# EAGLE design h_bridge_shield (EAGLE 7.6.0)
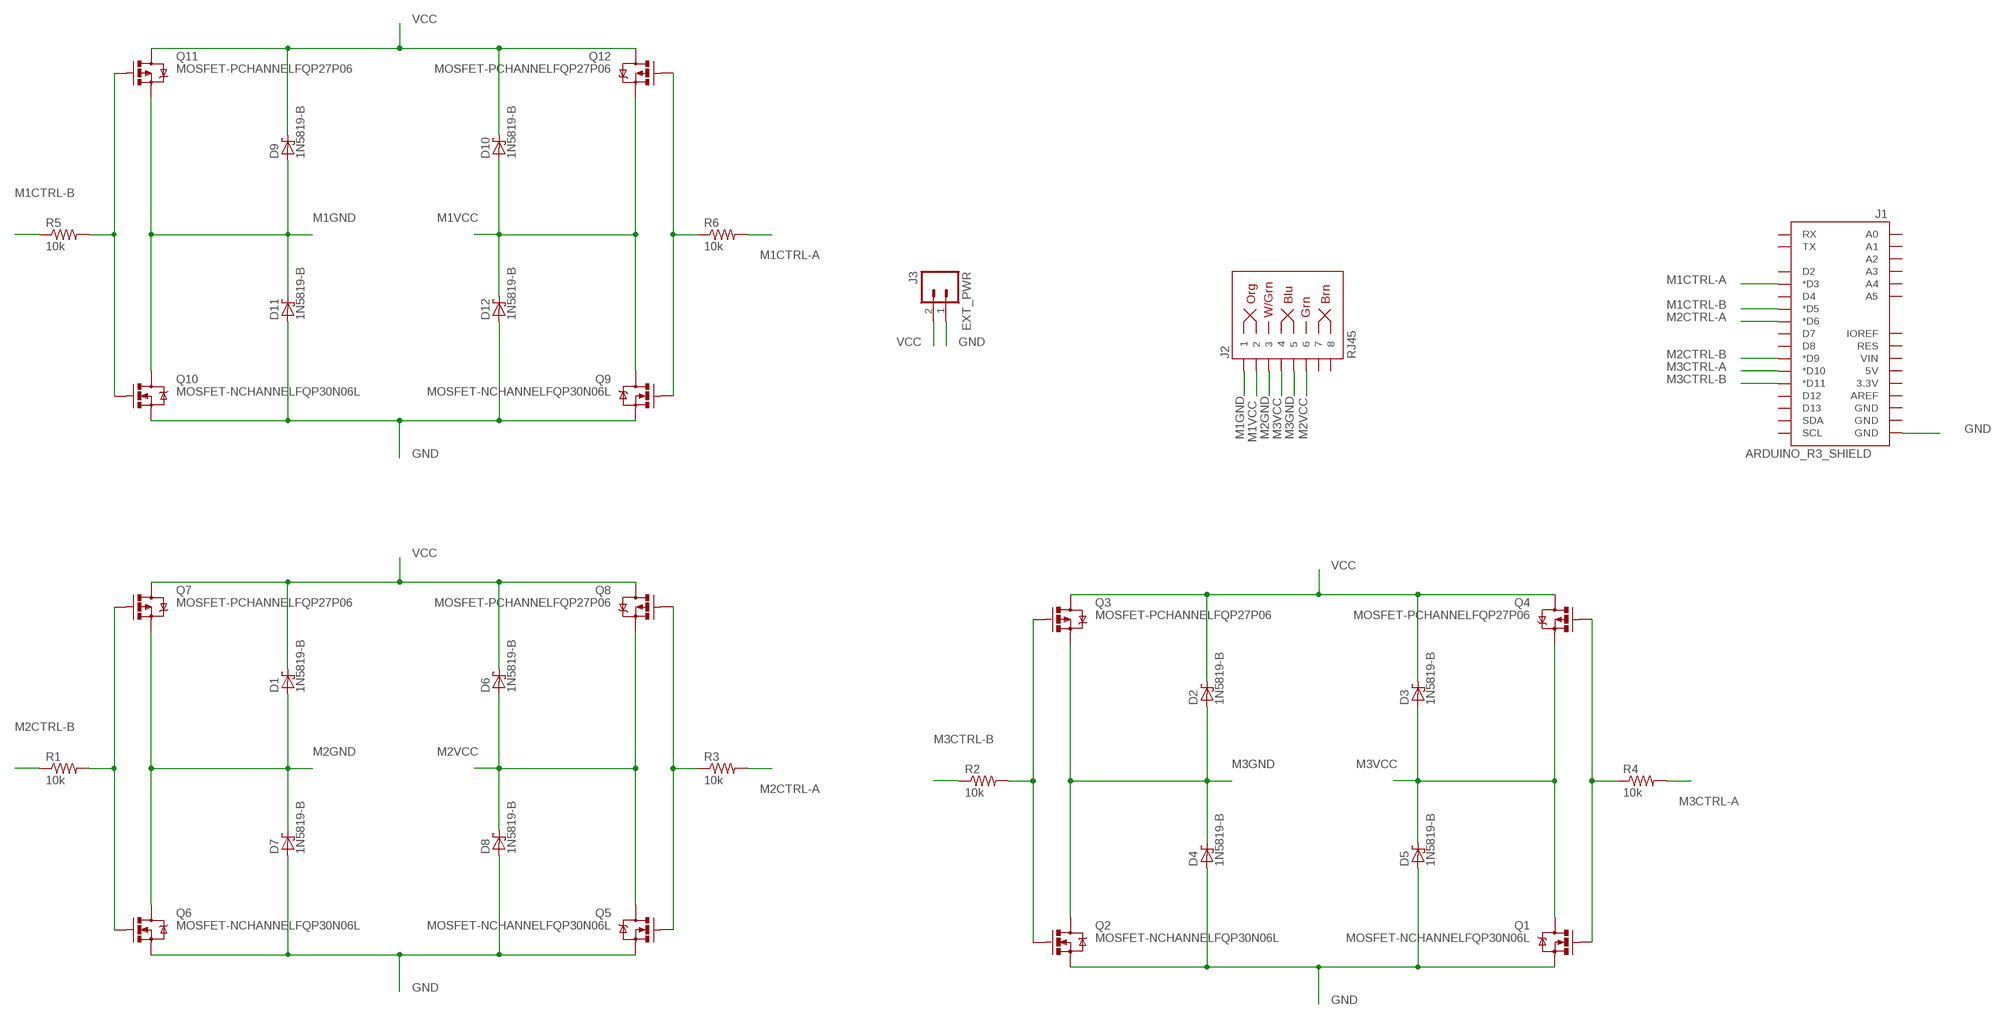
[diagram p0: schematic, sheet 1]

## Parts
D1  1N5819-B  [DO41-7.6]
D2  1N5819-B  [DO41-7.6]
D3  1N5819-B  [DO41-7.6]
D4  1N5819-B  [DO41-7.6]
D5  1N5819-B  [DO41-7.6]
D6  1N5819-B  [DO41-7.6]
D7  1N5819-B  [DO41-7.6]
D8  1N5819-B  [DO41-7.6]
D9  1N5819-B  [DO41-7.6]
D10  1N5819-B  [DO41-7.6]
D11  1N5819-B  [DO41-7.6]
D12  1N5819-B  [DO41-7.6]
J1  ARDUINO_R3_SHIELD  [UNO_R3_SHIELD]
J2  RJ45  RJ45-8PTH  [RJ45-8]
J3  EXT_PWR  M02JST-PTH-VERT  [JST-2-PTH-VERT]
Q1  MOSFET-NCHANNELFQP30N06L  [TO220V]
Q2  MOSFET-NCHANNELFQP30N06L  [TO220V]
Q3  MOSFET-PCHANNELFQP27P06  [TO220V]
Q4  MOSFET-PCHANNELFQP27P06  [TO220V]
Q5  MOSFET-NCHANNELFQP30N06L  [TO220V]
Q6  MOSFET-NCHANNELFQP30N06L  [TO220V]
Q7  MOSFET-PCHANNELFQP27P06  [TO220V]
Q8  MOSFET-PCHANNELFQP27P06  [TO220V]
Q9  MOSFET-NCHANNELFQP30N06L  [TO220V]
Q10  MOSFET-NCHANNELFQP30N06L  [TO220V]
Q11  MOSFET-PCHANNELFQP27P06  [TO220V]
Q12  MOSFET-PCHANNELFQP27P06  [TO220V]
R1  10k  10KOHM-1/4W5%(PTH)  [AXIAL-0.3]
R2  10k  10KOHM-1/4W5%(PTH)  [AXIAL-0.3]
R3  10k  10KOHM-1/4W5%(PTH)  [AXIAL-0.3]
R4  10k  10KOHM-1/4W5%(PTH)  [AXIAL-0.3]
R5  10k  10KOHM-1/4W5%(PTH)  [AXIAL-0.3]
R6  10k  10KOHM-1/4W5%(PTH)  [AXIAL-0.3]

## Nets
GND: D4.A D5.A D7.A D8.A D11.A D12.A J1.GND@0(GND) J3.1 Q1.3(S) Q2.3(S) Q5.3(S) Q6.3(S) Q9.3(S) Q10.3(S)
M1CTRL-A: J1.D3(*D3) R6.P$2
M1CTRL-B: J1.D5(*D5) R5.P$1
M1GND: D9.A D11.C J2.1 Q10.2(D) Q11.3(S)
M1VCC: D10.A D12.C J2.2 Q9.2(D) Q12.3(S)
M2CTRL-A: J1.D6(*D6) R3.P$2
M2CTRL-B: J1.D9(*D9) R1.P$1
M2GND: D1.A D7.C J2.3 Q6.2(D) Q7.3(S)
M2VCC: D6.A D8.C J2.6 Q5.2(D) Q8.3(S)
M3CTRL-A: J1.D10(*D10) R4.P$2
M3CTRL-B: J1.D11(*D11) R2.P$1
M3GND: D2.A D4.C J2.5 Q2.2(D) Q3.3(S)
M3VCC: D3.A D5.C J2.4 Q1.2(D) Q4.3(S)
N$1: Q5.1(G) Q8.1(G) R3.P$1
N$2: Q6.1(G) Q7.1(G) R1.P$2
N$3: Q9.1(G) Q12.1(G) R6.P$1
N$4: Q10.1(G) Q11.1(G) R5.P$2
N$5: Q1.1(G) Q4.1(G) R4.P$1
N$6: Q2.1(G) Q3.1(G) R2.P$2
VCC: D1.C D2.C D3.C D6.C D9.C D10.C J3.2 Q3.2(D) Q4.2(D) Q7.2(D) Q8.2(D) Q11.2(D) Q12.2(D)
Unconnected: J1.3.3V J1.5V J1.A0 J1.A1 J1.A2 J1.A3 J1.A4 J1.A5 J1.AREF J1.D2 J1.D4 J1.D7 J1.D8 J1.D12 J1.D13 J1.GND@1(GND) J1.GND@2(GND) J1.IOREF J1.RES J1.RX J1.SCL J1.SDA J1.TX J1.VIN J2.7 J2.8

## Library data of the parts
D1-D12 = diode:1N581*: 1.0A SCHOTTKY BARRIER RECTIFIER Source: http://www.diodes.com/datasheets/ds23001.pdf
J1 = SparkFun-Boards:ARDUINO_R3_SHIELD: Shield form compatible with the Arduino Uno R3.
J2 = SparkFun-Connectors:RJ45-8: RJ45 Jack Simple RJ45, 8-pin connection - connector for common Cat5, Cat5e, and Cat6 Ethernet cables. Footprint not yet proven in production. Connector sku is PRT-00643; Breakout PCB sku is BOB-00716.; PROD_ID: CONN-08506
J3 = SparkFun-Connectors:M02: Standard 2-pin 0.1" header. Use with - straight break away headers ( PRT-00116) - right angle break away headers (PRT-00553) - swiss pins (PRT-00743) - machine pins (PRT-00117) - female headers (PRT-00115) Molex polarized connector foot print use with: PRT-08233 with associated crimp pins and housings. 2.54_SCREWTERM for use with PRT-10571. 3.5mm Screw Terminal footprints for PRT-08084 5mm Screw Terminal footprints for use with PRT-08432
Q1 Q2 Q5 Q6 Q9 Q10 = SparkFun-DiscreteSemi:MOSFET-NCHANNEL: Common NMOSFET Parts MFG P/N Store ID Prod ID FDD8780 TRANS-09984 SI7820DN TRANS-11055 FDS6630A IC-08089 2N7002PW TRANS-11151 FQP30N06L COM-10213 TRANS-10060 BSS123LT1G TRANS-08345 BSS138 TRANS-00830 BS170 2N7000; PROD_ID: TRANS-10060
Q3 Q4 Q7 Q8 Q11 Q12 = SparkFun-DiscreteSemi:MOSFET-PCHANNEL: Generic PMOSFET IRLML2244 - TRANS-11153 (SOT-23 -20V -4.3A) (1.Gate 2.Source 3.Drain) FQP27P06 - COM-10349 <http://www.sparkfun.com/products/10349> (TO-220 -60V -27A) (1.Gate 2.Source 3.Drain)
R1-R6 = SparkFun-Resistors:10KOHM-1/4W5%(PTH): RES-09435; PROD_ID: RES-9435

## Board
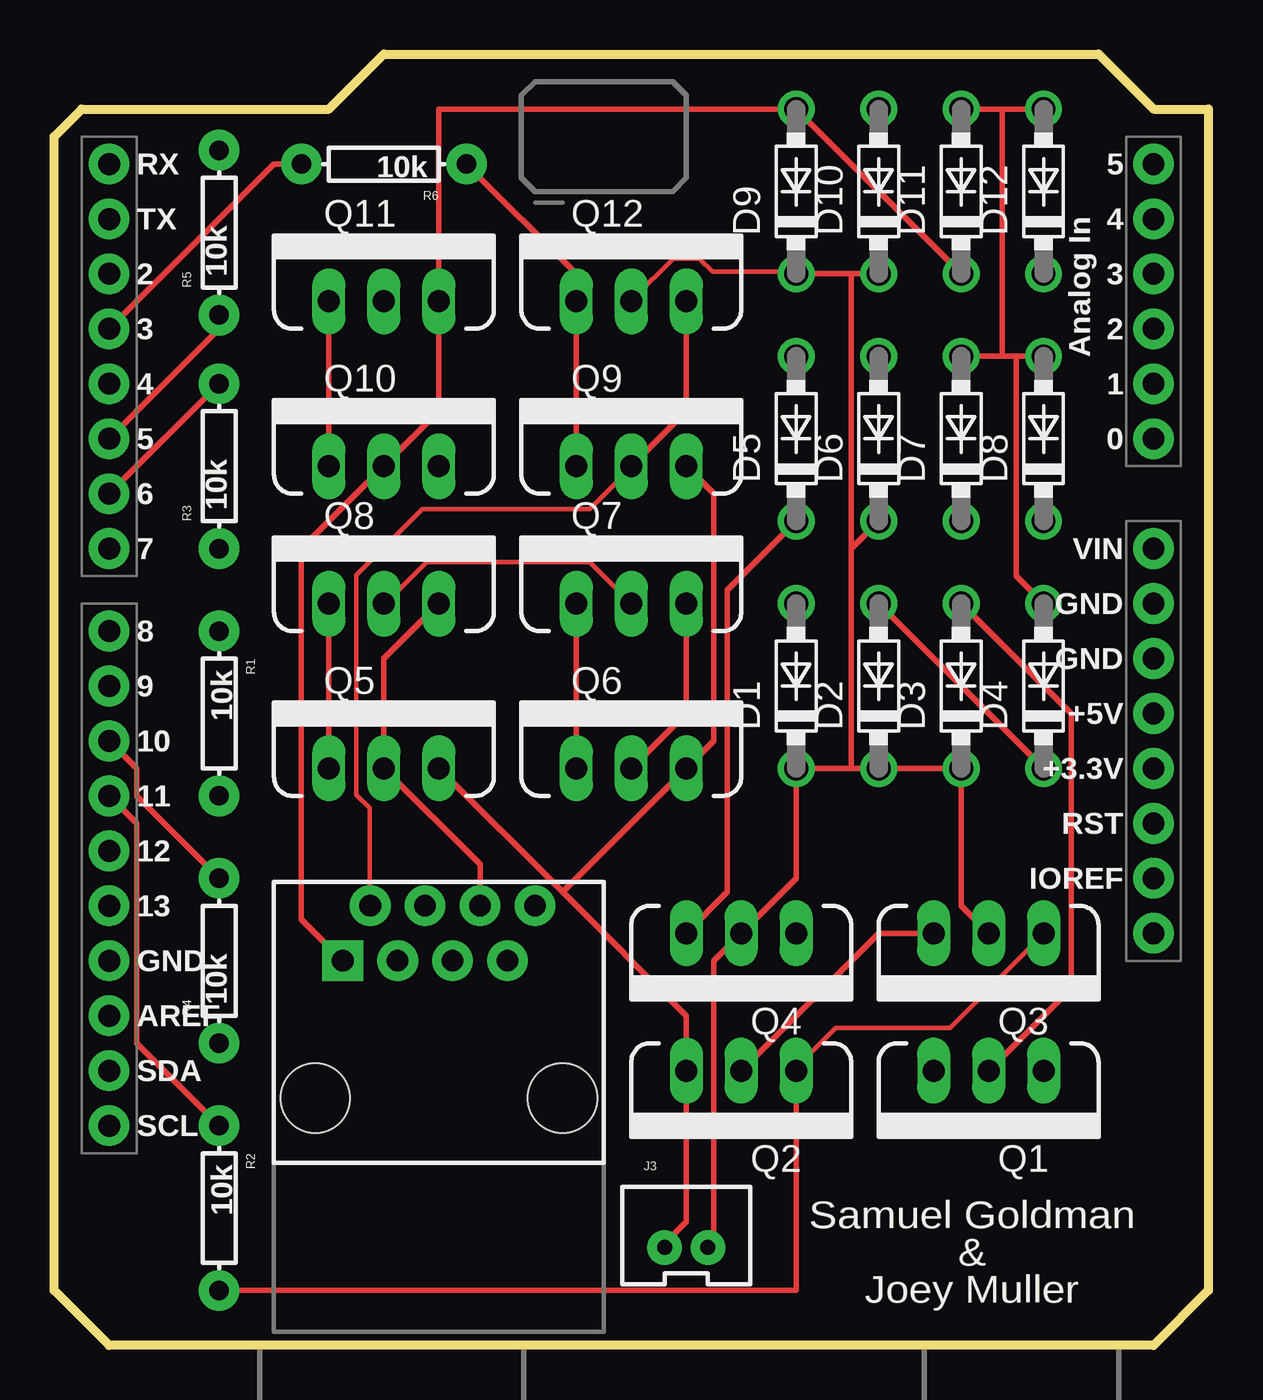
[diagram p1: board, top side]
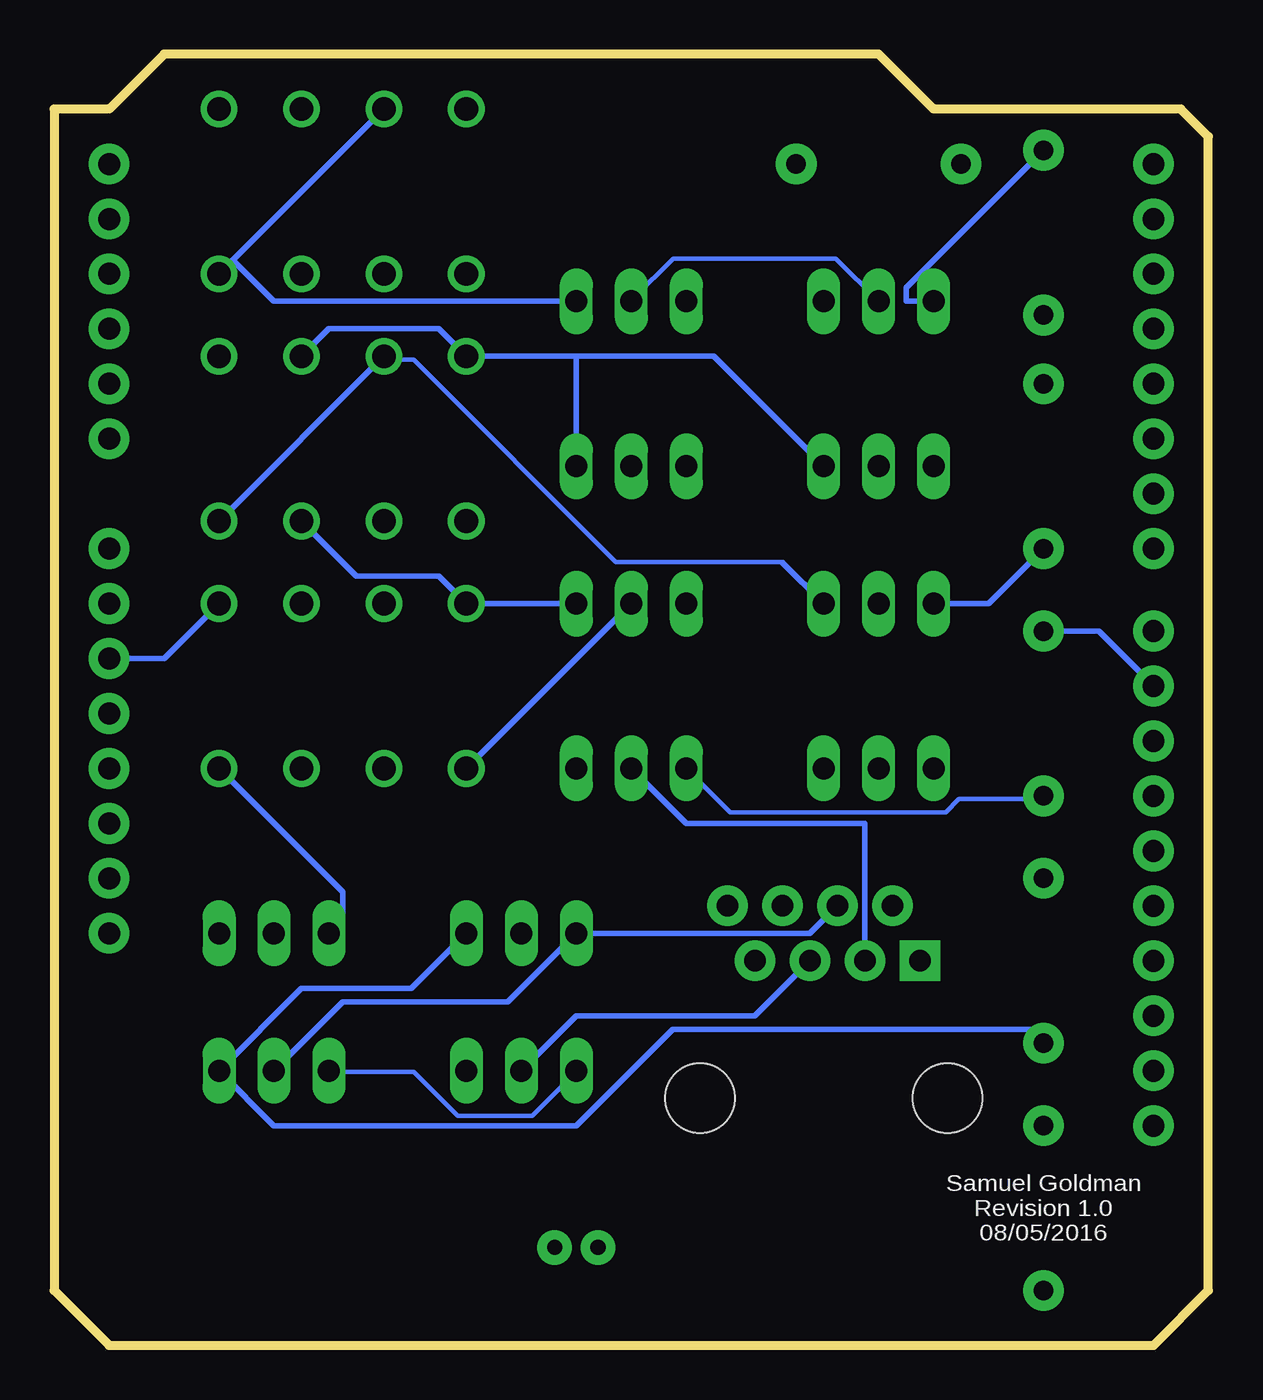
[diagram p2: board, bottom side, seen from below]

Size 53.34 x 59.69 mm. Coordinates in mm from the lower left corner, seen from the top.
Outline: 0,55.88 1.27,57.15 12.7,57.15 15.24,59.69 48.26,59.69 50.8,57.15 53.34,57.15 53.34,2.54 50.8,0 2.54,0 0,2.54 0,55.88
Copper layers (1*16): Top 0.0356mm / dielectric 1.5011mm / Bottom 0.0356mm
Design rules "oshpark-2layer": minimum track width 6mil, minimum drill 13mil, track to track 6mil, track to pad 6mil, pad to pad 6mil, via to via 6mil, smd to smd 6mil, copper to edge 15mil, drill to drill 6mil, minimum pad ring 7mil, minimum via ring 7mil, stop-mask expansion 2.5mil, vias tented up to drill 0mil, thermal gap 10mil

### Footprints (pad centres in the part's own frame; a part is rotated, then mirrored left to right if it is on the bottom)
DO41-7.6 = drill 1.1 pad 1.7: A 3.81,0; C -3.81,0
UNO_R3_SHIELD = drill 1.016 pad 1.88: 3.3V 50.8,26.67; 5V 50.8,29.21; A0 50.8,41.91; A1 50.8,44.45; A2 50.8,46.99; A3 50.8,49.53; A4 50.8,52.07; A5 50.8,54.61; AREF 2.54,15.24; D2 2.54,49.53; D3 2.54,46.99; D4 2.54,44.45; D5 2.54,41.91; D6 2.54,39.37; D7 2.54,36.83; D8 2.54,33.02; D9 2.54,30.48; D10 2.54,27.94; D11 2.54,25.4; D12 2.54,22.86; D13 2.54,20.32; GND@0 50.8,31.75; GND@1 50.8,34.29; GND@2 2.54,17.78; IOREF 50.8,21.59; NC 50.8,19.05; RES 50.8,24.13; RX 2.54,54.61; SCL 2.54,10.16; SDA 2.54,12.7; TX 2.54,52.07; VIN 50.8,36.83
RJ45-8 = drill 1 pad 1.88 square: 1 -4.445,6.35 | drill 1 pad 1.88: 2 -3.175,8.89; 3 -1.905,6.35; 4 -0.635,8.89; 5 0.635,6.35; 6 1.905,8.89; 7 3.175,6.35; 8 4.445,8.89 | hole 3.2: -5.715,0; 5.715,0
JST-2-PTH-VERT = drill 0.7 pad 1.6: 1 -1,-0.55; 2 1,-0.55
TO220V = drill 1.016 long: 1 -2.54,0; 2 0,0; 3 2.54,0
AXIAL-0.3 = drill 0.9 pad 1.88: P$1 -3.81,0; P$2 3.81,0

### Placement (x,y rotation side)
D1  34.29,30.48 90 top
D2  38.1,30.48 90 top
D3  41.91,30.48 90 top
D4  45.72,30.48 90 top
D5  34.29,41.91 90 top
D6  38.1,41.91 90 top
D7  41.91,41.91 90 top
D8  45.72,41.91 90 top
D9  34.29,53.34 90 top
D10  38.1,53.34 90 top
D11  41.91,53.34 90 top
D12  45.72,53.34 90 top
J1  0,0 0 top
J2  17.78,11.43 0 top
J3  29.21,5.08 0 top
Q1  43.18,12.7 180 top
Q2  31.75,12.7 180 top
Q3  43.18,19.05 180 top
Q4  31.75,19.05 180 top
Q5  15.24,26.67 0 top
Q6  26.67,26.67 0 top
Q7  26.67,34.29 0 top
Q8  15.24,34.29 0 top
Q9  26.67,40.64 0 top
Q10  15.24,40.64 0 top
Q11  15.24,48.26 0 top
Q12  26.67,48.26 0 top
R1  7.62,29.21 270 top
R2  7.62,6.35 270 top
R3  7.62,40.64 90 top
R4  7.62,17.78 90 top
R5  7.62,51.44 90 top
R6  15.24,54.61 180 top

### Tracks (layer width: path | path; a pad name or v marks a point on that pad's centre or on a via)
GND
  Top 0.254: 23.5,20.96 29.21,15.24 Q2.3 29.21,5.71 28.57,5.08 J3.1 | 23.5,20.96 Q5.3 | 23.5,20.96 Q6.3 30.48,27.94 30.48,39.37 Q9.3 | D8.A 44.45,45.72 | 44.45,45.72 43.81,45.72 | 43.81,45.72 D7.A | D12.A 43.81,57.15 | 43.81,57.15 D11.A | 43.81,57.15 43.81,45.72 | D4.A 44.45,35.56 44.45,45.72
  Bottom 0.203: Q1.3 40.59,12.65 36.73,12.65 34.7,10.62 31.24,10.62 29.21,12.65 Q2.3
  Bottom 0.254: Q10.3 22.86,45.72 29.21,45.72 | 29.21,45.72 D5.A 35.56,46.99 40.64,46.99 D7.A | 29.21,45.72 Q9.3 | D4.A 48.26,31.75 J1.GND@0
M1CTRL-A
  Top 0.254: J1.D3 10.16,54.61 R6.P$2
M1CTRL-B
  Top 0.254: J1.D5 7.62,46.99 R5.P$1
M1GND
  Top 0.254: D11.C D9.A 17.78,57.15 Q11.3 17.78,43.18 Q10.2 11.43,36.83 11.43,19.68 J2.1
M1VCC
  Top 0.203: J2.2 14.58,20.37 14.58,24.84 13.97,25.45 13.97,35.61 17.02,38.66 24.74,38.66 26.57,40.49 Q9.2
  Top 0.254: Q9.2 29.21,43.18 Q12.3
  Bottom 0.254: D10.A 45.08,50.17 | 45.08,50.17 D12.C | 45.08,50.17 43.18,48.26 Q12.3
M2CTRL-A
  Top 0.254: R3.P$2 J1.D6
M2CTRL-B
  Bottom 0.254: J1.D9 5.08,33.02 R1.P$1
M2GND
  Top 0.254: Q6.2 29.21,29.21 Q7.3
  Bottom 0.254: Q7.3 D1.A 35.56,35.56 39.37,35.56 D7.C | J2.3 15.87,24.13 24.13,24.13 Q6.2
M2VCC
  Top 0.254: J2.6 19.68,22.22 Q5.2 15.24,31.75 Q8.3
  Bottom 0.203: D6.A 37.95,45.57 36.73,45.57 27.38,36.22 19.66,36.22 19.68,36.19
  Bottom 0.254: D8.C D6.A | Q8.3 19.68,36.19
M3CTRL-A
  Top 0.254: R4.P$2 3.81,25.4 3.81,26.67 J1.D10
M3CTRL-B
  Top 0.254: R2.P$1 3.81,13.97 3.81,24.13 J1.D11
M3GND
  Top 0.254: D4.C D2.A | Q2.2 38.1,19.05 Q3.3
  Bottom 0.254: J2.5 20.96,15.24 29.21,15.24 Q2.2 | D4.C 40,20.96 40,19.05 Q3.3
M3VCC
  Top 0.254: D5.C 31.11,34.92 31.11,20.96 Q4.3 | D3.A 46.99,29.21 46.99,16.51 Q1.2
  Bottom 0.254: J2.4 18.41,19.05 Q4.3 32.39,15.87 40,15.87 Q1.2
N$1
  Top 0.254: Q8.1 Q5.1
  Bottom 0.254: R3.P$1 10.16,34.29 Q8.1
N$2
  Top 0.254: Q7.1 Q6.1
  Bottom 0.203: Q6.1 22.1,24.64 12.14,24.64 11.53,25.25 7.67,25.25 R1.P$2
N$3
  Top 0.254: Q9.1 Q12.1 24.13,49.53 R6.P$1
N$4
  Top 0.254: Q11.1 Q10.1
  Bottom 0.254: R5.P$2 13.97,48.89 13.97,48.26 Q11.1
N$5
  Bottom 0.254: Q4.1 36.83,16.51 41.91,16.51 Q1.1 43.18,10.16 29.21,10.16 24.76,14.61 8.25,14.61 R4.P$1
N$6
  Top 0.203: Q3.1 45.67,18.95 41.4,14.68 36.12,14.68 34.29,12.85 Q2.1
  Top 0.254: R2.P$2 34.29,2.54 Q2.1
VCC
  Top 0.203: Q7.2 24.74,36.22 17.22,36.22 15.39,34.39 Q8.2 | D9.C 34.29,49.63 30.43,49.63 29.82,50.24 28.6,50.24 26.77,48.41 Q12.2
  Top 0.254: D10.C 36.83,49.53 | 36.83,49.53 D9.C | Q3.2 41.91,20.32 D3.C D2.C 36.83,26.67 | J3.2 30.48,5.08 30.48,17.78 Q4.2 34.29,21.59 D1.C 36.83,26.67 | 36.83,36.83 D6.C | 36.83,26.67 36.83,36.83 | 36.83,36.83 36.83,49.53
  Bottom 0.203: Q11.2 17.22,50.24 24.74,50.24 26.57,48.41 Q12.2
  Bottom 0.254: D1.C Q7.2

### Text on the board
tPlace: Samuel Goldman / & / Joey Muller
bPlace: Samuel Goldman / Revision 1.0 / 08/05/2016